# EasyEDA schematic SCH_uCompute_NRF24L01_module_2026-03-19.json
TITLE: Adapteur_uCompute NRF20L01+; REV: 1.01; Date: 2026-03-02; Sheet: 1/1; Drawn By: JP; Company: Your Company
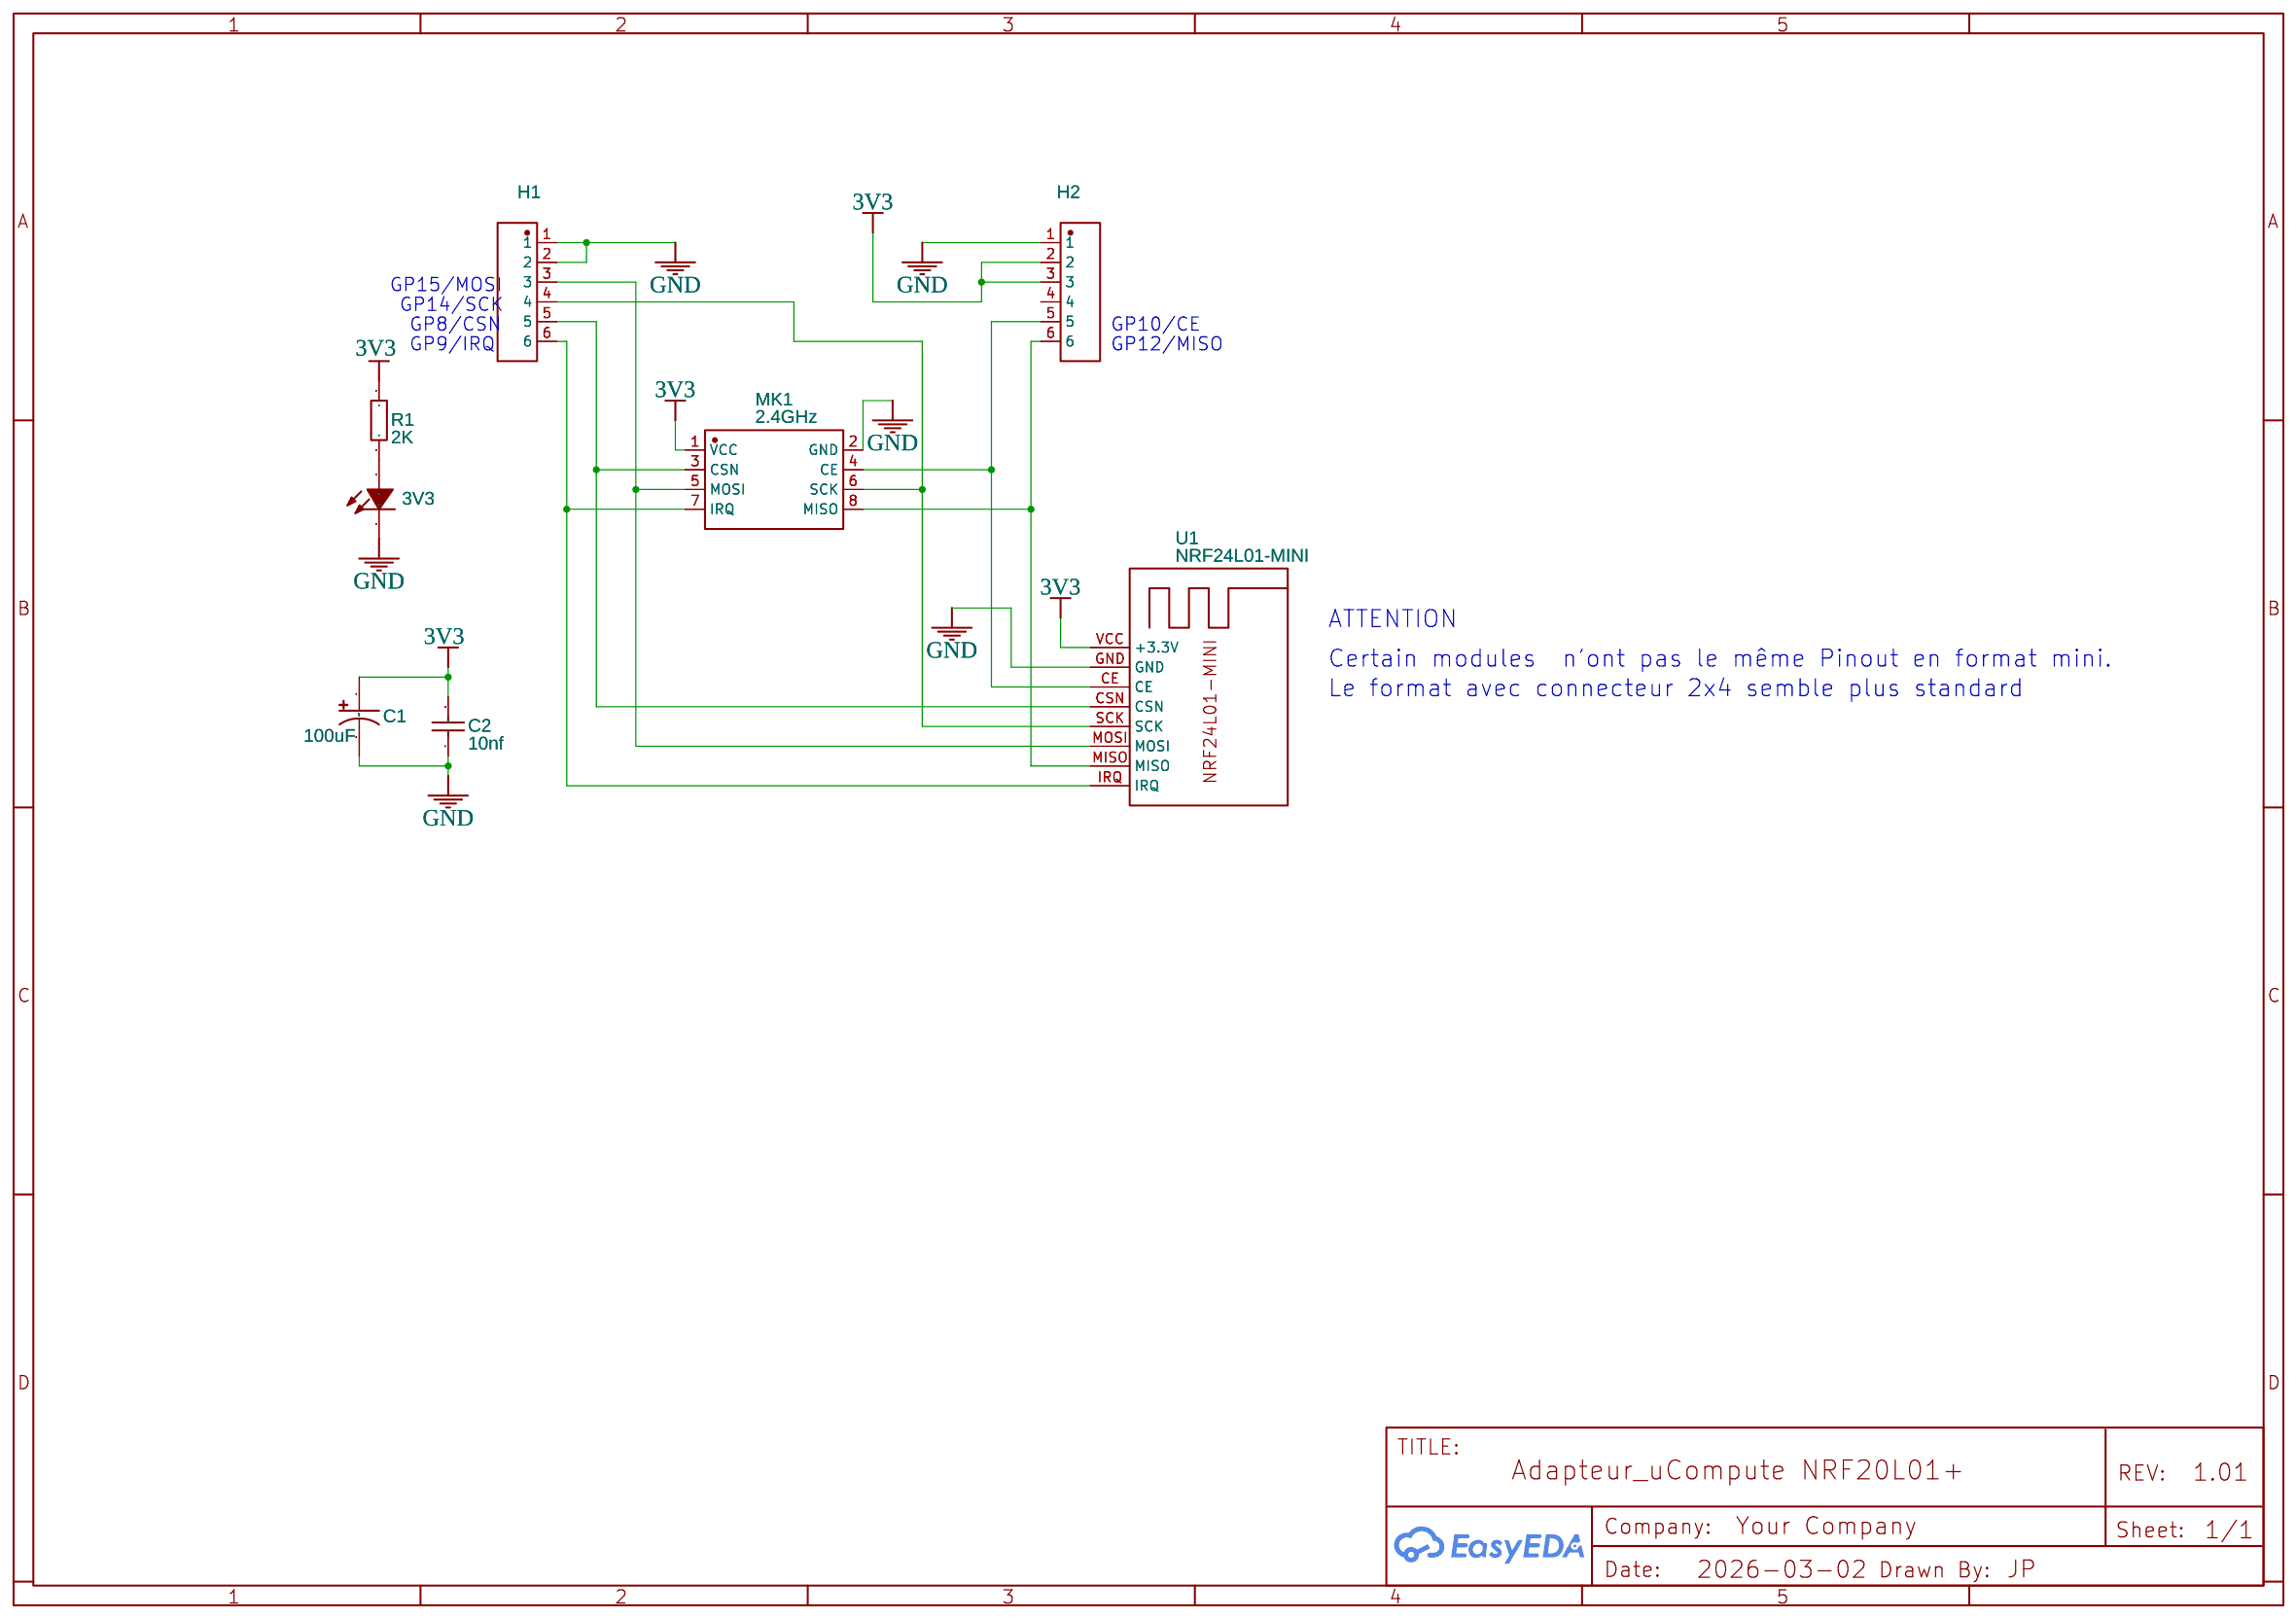
[diagram p0: schematic sheet]

## Parts
3V3  XL-1206QPC  [LED0805-RD_BLUE]
C1  100uF  [CASE-B_3528]
C2  10nf  [C0805]
H1  KH-2.54PH180-1X6P-L11.5  [HDR-TH_6P-P2.54-V-M-1]
H2  KH-2.54PH180-1X6P-L11.5  [HDR-TH_6P-P2.54-V-M-1]
MK1  2.4GHz  [WIRELM-SMD_L28.6-W15.3-P2.54_NRF24L01]
R1  2K  [R0805]
U1  NRF24L01-MINI  [NRF24L01 MINI]

## Library data of the parts
3V3 = XL-1206QPC: Supplier: LCSC; Manufacturer: LCSC; Supplier Part: C10781; JLCPCB Part Class: Extended Part; Package Display: No
C1 = TLJA107M010R1400: Supplier: LCSC; Supplier Part: C313517; Manufacturer: Kyocera AVX; Contributor: LCSC; JLCPCB Part Class: Extended Part; Package Display: No
C2 = 0805CG220J500NT: Supplier: LCSC; Manufacturer: FH; Supplier Part: C38143; JLCPCB Part Class: Extended Part
H1 H2 = KH-2.54PH180-1X6P-L11.5: Contributor: LCSC; Supplier: LCSC; Supplier Part: C2905486; Manufacturer: kinghelm(金航标); JLCPCB Part Class: Extended Part
MK1 = NRF24L01: Supplier: LCSC; Manufacturer: Ai-Thinker(安信可); Manufacturer Part: NF-04; Supplier Part: C90751; JLCPCB Part Class: Extended Part
R1 = RC0805DR-071KL: Supplier: LCSC; Manufacturer: YAGEO(国巨); Contributor: LCSC; Supplier Part: C100051; JLCPCB Part Class: Extended Part; Resistance: 1kΩ
U1 = NRF24L01-MINI: Contributor: opsprog

## Nets
3V3: C1.1 C2.2 H2.2 H2.3 MK1.1(VCC) R1.1 U1.VCC(+3.3V)
GND: 3V3.1(K) C1.2 C2.1 H1.1 H1.2 H2.1 MK1.2(GND) U1.GND
Net-(3V3-2): 3V3.2(A) R1.2
Net-(H1-3): H1.3 MK1.5(MOSI) U1.MOSI
Net-(H1-4): H1.4 MK1.6(SCK) U1.SCK
Net-(H1-5): H1.5 MK1.3(CSN) U1.CSN
Net-(H1-6): H1.6 MK1.7(IRQ) U1.IRQ
Net-(H2-5): H2.5 MK1.4(CE) U1.CE
Net-(H2-6): H2.6 MK1.8(MISO) U1.MISO

Not connected (* = marked no-connect by the designer): H2 4

## Notes on the sheet
- GP15/MOSI
- GP14/SCK
- GP8/CSN
- GP10/CE
- GP9/IRQ
- GP12/MISO
- ATTENTION
- Certain modules  n'ont pas le même Pinout en format mini.
- Le format avec connecteur 2x4 semble plus standard
